# EAGLE design 100kw-DC-Motor-ESC  (EAGLE 7.4.0)
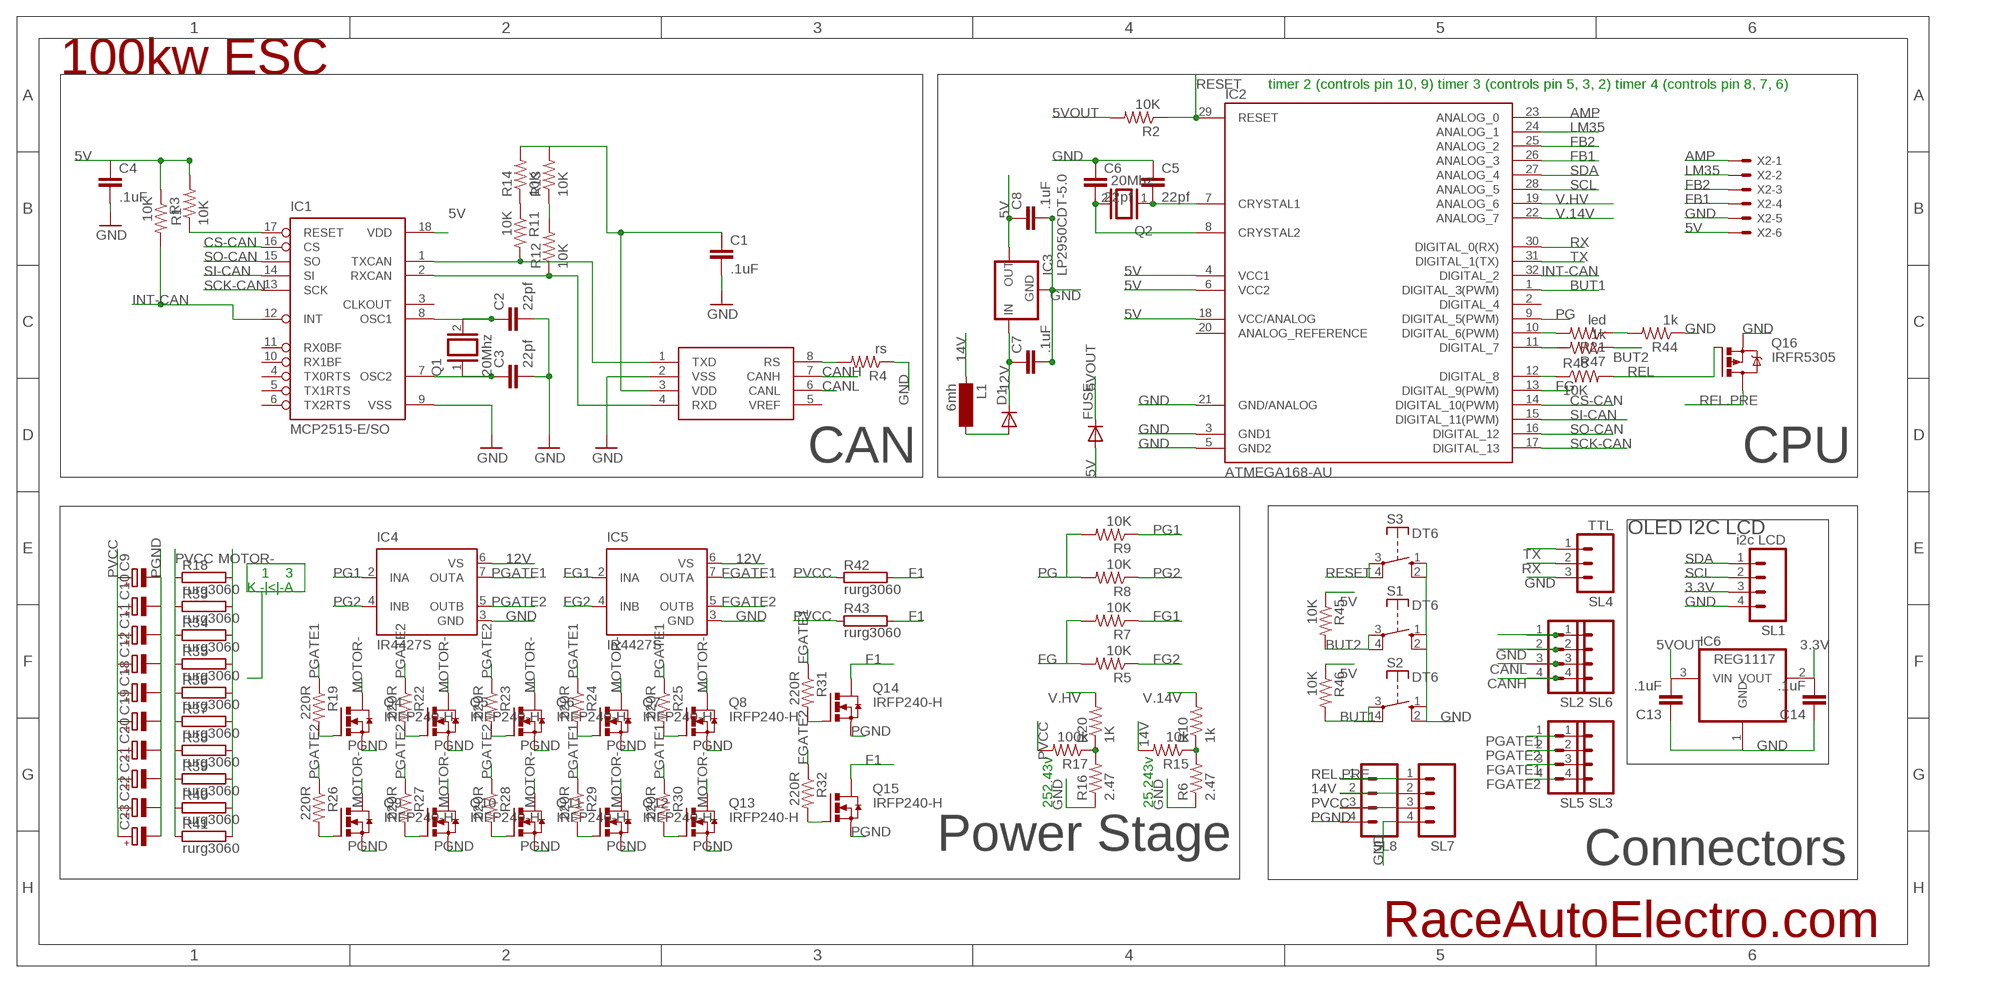
[diagram p0: schematic, sheet 1]

## Parts
C1  .1uF  CAP0805  [0805]
C2  22pf  CAP0805  [0805]
C3  22pf  CAP0805  [0805]
C4  .1uF  CAP1210  [1210]
C5  22pf  CAP0805  [0805]
C6  22pf  CAP0805  [0805]
C7  .1uF  CAP1210  [1210]
C8  .1uF  CAP1210  [1210]
C9  CPOL-EUE10-35  [EB35D]
C10  CPOL-EUE10-35  [EB35D]
C11  CPOL-EUE10-35  [EB35D]
C12  CPOL-EUE10-35  [EB35D]
C13  .1uF  CAP1210  [1210]
C14  .1uF  CAP1210  [1210]
C18  CPOL-EUE10-35  [EB35D]
C19  CPOL-EUE10-35  [EB35D]
C20  CPOL-EUE10-35  [EB35D]
C21  CPOL-EUE10-35  [EB35D]
C22  CPOL-EUE10-35  [EB35D]
C23  CPOL-EUE10-35  [EB35D]
D1  DIODE-DO-214AC  [DO-214AC]
FUSE  DIODE-DO-214AC  [DO-214AC]
IC1  MCP2515-E/SO  [SO18L]
IC2  ATMEGA168-AU  [TQFP32-08]
IC3  LP2950CDT-5.0  [DPACK]
IC4  IR4427S  [SO08]
IC5  IR4427S  [SO08]
IC6  REG1117  [SOT223]
L1  6mh  MS85  [MS85]
Q1  20Mhz  XTAL/S  [QS]
Q2  20Mhz  XTAL/S  [QS]
Q4  IRFP240-H  [TO247BH]
Q5  IRFP240-H  [TO247BH]
Q6  IRFP240-H  [TO247BH]
Q7  IRFP240-H  [TO247BH]
Q8  IRFP240-H  [TO247BH]
Q9  IRFP240-H  [TO247BH]
Q10  IRFP240-H  [TO247BH]
Q11  IRFP240-H  [TO247BH]
Q12  IRFP240-H  [TO247BH]
Q13  IRFP240-H  [TO247BH]
Q14  IRFP240-H  [TO247BH]
Q15  IRFP240-H  [TO247BH]
Q16  IRFR5305  [D-PAK_TO252AA]
R1  10K  RESISTOR0805-RES  [0805]
R2  10K  RESISTOR1206  [1206]
R3  10K  RESISTOR0805-RES  [0805]
R4  rs  RESISTOR0805-RES  [0805]
R5  10K  RESISTOR0805-RES  [0805]
R6  2.47  RESISTOR0805-RES  [0805]
R7  10K  RESISTOR0805-RES  [0805]
R8  10K  RESISTOR0805-RES  [0805]
R9  10K  RESISTOR0805-RES  [0805]
R10  1k  RESISTOR0805-RES  [0805]
R11  10K  RESISTOR0805-RES  [0805]
R12  10K  RESISTOR0805-RES  [0805]
R13  10K  RESISTOR0805-RES  [0805]
R14  10K  RESISTOR0805-RES  [0805]
R15  10k  RESISTOR0805-RES  [0805]
R16  2.47  RESISTOR0805-RES  [0805]
R17  100k  RESISTOR0805-RES  [0805]
R18  rurg3060  RMG100-H  [TO-247-2H]
R19  220R  RESISTOR0805-RES  [0805]
R20  1K  RESISTOR0805-RES  [0805]
R21  led  RESISTOR1206  [1206]
R22  220R  RESISTOR0805-RES  [0805]
R23  220R  RESISTOR0805-RES  [0805]
R24  220R  RESISTOR0805-RES  [0805]
R25  220R  RESISTOR0805-RES  [0805]
R26  220R  RESISTOR0805-RES  [0805]
R27  220R  RESISTOR0805-RES  [0805]
R28  220R  RESISTOR0805-RES  [0805]
R29  220R  RESISTOR0805-RES  [0805]
R30  220R  RESISTOR0805-RES  [0805]
R31  220R  RESISTOR0805-RES  [0805]
R32  220R  RESISTOR0805-RES  [0805]
R33  rurg3060  RMG100-H  [TO-247-2H]
R34  rurg3060  RMG100-H  [TO-247-2H]
R35  rurg3060  RMG100-H  [TO-247-2H]
R36  rurg3060  RMG100-H  [TO-247-2H]
R37  rurg3060  RMG100-H  [TO-247-2H]
R38  rurg3060  RMG100-H  [TO-247-2H]
R39  rurg3060  RMG100-H  [TO-247-2H]
R40  rurg3060  RMG100-H  [TO-247-2H]
R41  rurg3060  RMG100-H  [TO-247-2H]
R42  rurg3060  RMG100-H  [TO-247-2H]
R43  rurg3060  RMG100-H  [TO-247-2H]
R44  1k  RESISTOR0805-RES  [0805]
R45  10K  RESISTOR0805-RES  [0805]
R46  10K  RESISTOR0805-RES  [0805]
R47  1k  RESISTOR0805-RES  [0805]
R48  10K  RESISTOR0805-RES  [0805]
S1  DT6  [DT6]
S2  DT6  [DT6]
S3  DT6  [DT6]
SL1  i2c LCD  M04  [04P]
SL2  M04  [04P]
SL3  M04  [04P]
SL4  TTL  M03  [03P]
SL5  M04  [04P]
SL6  M04  [04P]
SL7  M04  [04P]
SL8  M04  [04P]
U1  MCP2551  [SO08]
X2  22-23-2061  [22-23-2061]

## Nets
3.3V: C14.2 IC6.2(VOUT) SL1.3
5V: C1.1 C4.1 C8.1 FUSE.A IC1.18(VDD) IC2.4(VCC1) IC2.6(VCC2) IC2.18(VCC/ANALOG) IC3.3(OUT) R1.2 R3.1 R13.2 R14.2 R45.1 R46.1 U1.3(VDD) X2.6
5VOUT: C13.2 FUSE.C IC6.3(VIN) R2.2
12V: C7.1 D1.C IC3.1(IN) IC4.6(VS) IC5.6(VS)
14V: L1.1 R15.2 SL7.2 SL8.2
AMP: IC2.23(ANALOG_0) X2.1
BUT1: IC2.1(DIGITAL_3(PWM)) R46.2 S2.3(P) S2.4(P)
BUT2: R45.2 R47.1 S1.3(P) S1.4(P)
BUT2R: IC2.11(DIGITAL_7) R47.2
CANH: SL2.4 SL6.4 U1.7(CANH)
CANL: SL2.3 SL6.3 U1.6(CANL)
CS-CAN: IC1.16(CS) IC2.14(DIGITAL_10(PWM))
F1: Q14.D Q15.D R42.2 R43.2
FB1: IC2.26(ANALOG_3) X2.4
FB2: IC2.25(ANALOG_2) X2.3
FG: IC2.13(DIGITAL_9(PWM)) R5.2 R7.2
FG1: IC5.2(INA) R7.1
FG2: IC5.4(INB) R5.1
FGATE1: IC5.7(OUTA) R31.1 SL3.3 SL5.3
FGATE2: IC5.5(OUTB) R32.1 SL3.4 SL5.4
GND: C1.2 C2.2 C3.2 C4.2 C5.1 C6.1 C7.2 C8.2 C13.1 C14.1 IC1.9(VSS) IC2.3(GND1) IC2.5(GND2) IC2.21(GND/ANALOG) IC3.4(GND) IC4.3(GND) IC5.3(GND) IC6.1(GND) Q16.3(S) R4.1 R6.1 R16.1 R44.1 S1.1(S) S1.2(S) S2.1(S) S2.2(S) S3.1(S) S3.2(S) SL1.4 SL2.2 SL4.3 SL6.2 SL7.4 U1.2(VSS) X2.5
INT-CAN: IC1.12(INT) IC2.32(DIGITAL_2) R3.2
LM35: IC2.24(ANALOG_1) X2.2
MOTOR-: Q4.D Q5.D Q6.D Q7.D Q8.D Q9.D Q10.D Q11.D Q12.D Q13.D R18.2 R33.2 R34.2 R35.2 R36.2 R37.2 R38.2 R39.2 R40.2 R41.2
N$1: R4.2 U1.8(RS)
N$2: IC1.1(TXCAN) R11.2 U1.1(TXD)
N$3: IC1.2(RXCAN) R12.1 U1.4(RXD)
N$4: C2.1 IC1.8(OSC1) Q1.2
N$5: C3.1 IC1.7(OSC2) Q1.1
N$6: C5.2 IC2.7(CRYSTAL1) Q2.1
N$7: Q4.G R19.2
N$8: IC1.17(RESET) R1.1
N$9: C6.2 IC2.8(CRYSTAL2) Q2.2
N$11: IC2.12(DIGITAL_8) R48.1
N$13: D1.A L1.2
N$15: R12.2 R13.1
N$16: Q5.G R22.2
N$17: R11.1 R14.1
N$18: Q6.G R23.2
N$19: Q7.G R24.2
N$20: Q8.G R25.2
N$21: Q9.G R26.2
N$22: Q10.G R27.2
N$23: Q11.G R28.2
N$24: Q12.G R29.2
N$25: Q13.G R30.2
N$26: Q14.G R31.2
N$27: Q15.G R32.2
N$39: SL2.1 SL6.1
N$55: R6.2 R10.1 R15.1
N$57: IC2.10(DIGITAL_6(PWM)) R21.2
N$58: R21.1 R44.2
N$59: R16.2 R17.1 R20.1
PG: IC2.9(DIGITAL_5(PWM)) R8.2 R9.2
PG1: IC4.2(INA) R9.1
PG2: IC4.4(INB) R8.1
PGATE1: IC4.7(OUTA) R19.1 R24.1 R25.1 R29.1 R30.1 SL3.1 SL5.1
PGATE2: IC4.5(OUTB) R22.1 R23.1 R26.1 R27.1 R28.1 SL3.2 SL5.2
PGND: C9.- C10.- C11.- C12.- C18.- C19.- C20.- C21.- C22.- C23.- Q4.S Q5.S Q6.S Q7.S Q8.S Q9.S Q10.S Q11.S Q12.S Q13.S Q14.S Q15.S SL8.4
PVCC: C9.+ C10.+ C11.+ C12.+ C18.+ C19.+ C20.+ C21.+ C22.+ C23.+ R17.2 R18.1 R33.1 R34.1 R35.1 R36.1 R37.1 R38.1 R39.1 R40.1 R41.1 R42.1 R43.1 SL7.3 SL8.3
REL: Q16.1(G) R48.2
REL.PRE: Q16.4(D) SL7.1 SL8.1
RESET: IC2.29(RESET) R2.1 S3.3(P) S3.4(P)
RX: IC2.30(DIGITAL_0(RX)) SL4.2
SCK-CAN: IC1.13(SCK) IC2.17(DIGITAL_13)
SCL: IC2.28(ANALOG_5) SL1.2
SDA: IC2.27(ANALOG_4) SL1.1
SI-CAN: IC1.14(SI) IC2.15(DIGITAL_11(PWM))
SO-CAN: IC1.15(SO) IC2.16(DIGITAL_12)
TX: IC2.31(DIGITAL_1(TX)) SL4.1
V.14V: IC2.22(ANALOG_7) R10.2
V.HV: IC2.19(ANALOG_6) R20.2
Unconnected: IC1.3(CLKOUT) IC1.4(TX0RTS) IC1.5(TX1RTS) IC1.6(TX2RTS) IC1.10(RX1BF) IC1.11(RX0BF) IC2.2(DIGITAL_4) IC2.20(ANALOG_REFERENCE) U1.5(VREF)

## Notes on the sheet
- 100kw ESC
- timer 2 (controls pin 10, 9) timer 3 (controls pin 5, 3, 2) timer 4 (controls pin 8, 7, 6)
- CAN | CPU
- OLED I2C LCD
- 1    3
- K -|<|-A
- 252.43v | 25.243v
- Power Stage | Connectors
- RaceAutoElectro.com

## Library data of the parts
C1-C8 C13 C14 = SparkFun:CAP: Capacitor Standard 0603 ceramic capacitor, and 0.1" leaded capacitor.
C9-C12 C18-C23 = rcl:CPOL-EU: POLARIZED CAPACITOR, European symbol
D1 FUSE = diode:DIODE-: DIODE
IC1 = mcp2515:MCP2515
IC2 = Arduino-AVR:ATMEGA168
IC3 = v-reg:LP2950?*: Source: http://cache.national.com/ds/LP/LP2950.pdf
IC4 IC5 = ir:IR4427: DUAL LOW SIDE DRIVER Source: ID4426.pdf; MF: INTERNATIONAL RECTIFIER(IR); MPN: IR4427STRPBF; OC_FARNELL: 8639094; OC_NEWARK: 63J7933
IC6 = burr-brown:REG1117: 800mA and 1A Low Dropout (LDO) Positive Regulator 1.8V, 2.5V, 2.85V, 3.3V, 5V, and Adj; MPN: REG1117; OC_FARNELL: 1097566; OC_NEWARK: 14P6981
L1 = inductor-neosid:MS85: INDUCTOR SMD power inductor
Q1 Q2 = special:XTAL/S: CRYSTAL
Q4-Q15 = transistor-power:IRFP240: HEXFET Power MosFet Source: http://www.irf.com/
Q16 = transistor-power:IRF?5305: HEXFET Power MOSFET Source: http://www.irf.com/product-info/datasheets/data/irfr5305pbf.pdf
R1-R17 R19-R32 R44-R48 = SparkFun:RESISTOR: Resistor Basic schematic elements and footprints for 0603, 1206, and PTH resistors.
R18 R33-R43 = resistor-power:RMG100: TO-247 Power Resistor - RMG 100 Series Source: www.token.com.tw .. power-resistor-rmg100pdf; OC_FARNELL: unknown; OC_NEWARK: unknown
S1-S3 = switch-misc:DT: ITT SWITCH
SL1-SL3 SL5-SL8 = con-amp-quick:M04: AMP QUICK CONNECTOR; OC_FARNELL: unknown; OC_NEWARK: unknown
SL4 = con-amp-quick:M03: AMP QUICK CONNECTOR; OC_FARNELL: unknown; OC_NEWARK: unknown
U1 = SparkFun:MCP2551
X2 = con-molex:22-23-2061: .100" (2.54mm) Center Header - 6 Pin; MF: MOLEX; MPN: 22-23-2061; OC_FARNELL: 1462922; OC_NEWARK: 27C1933

## Board
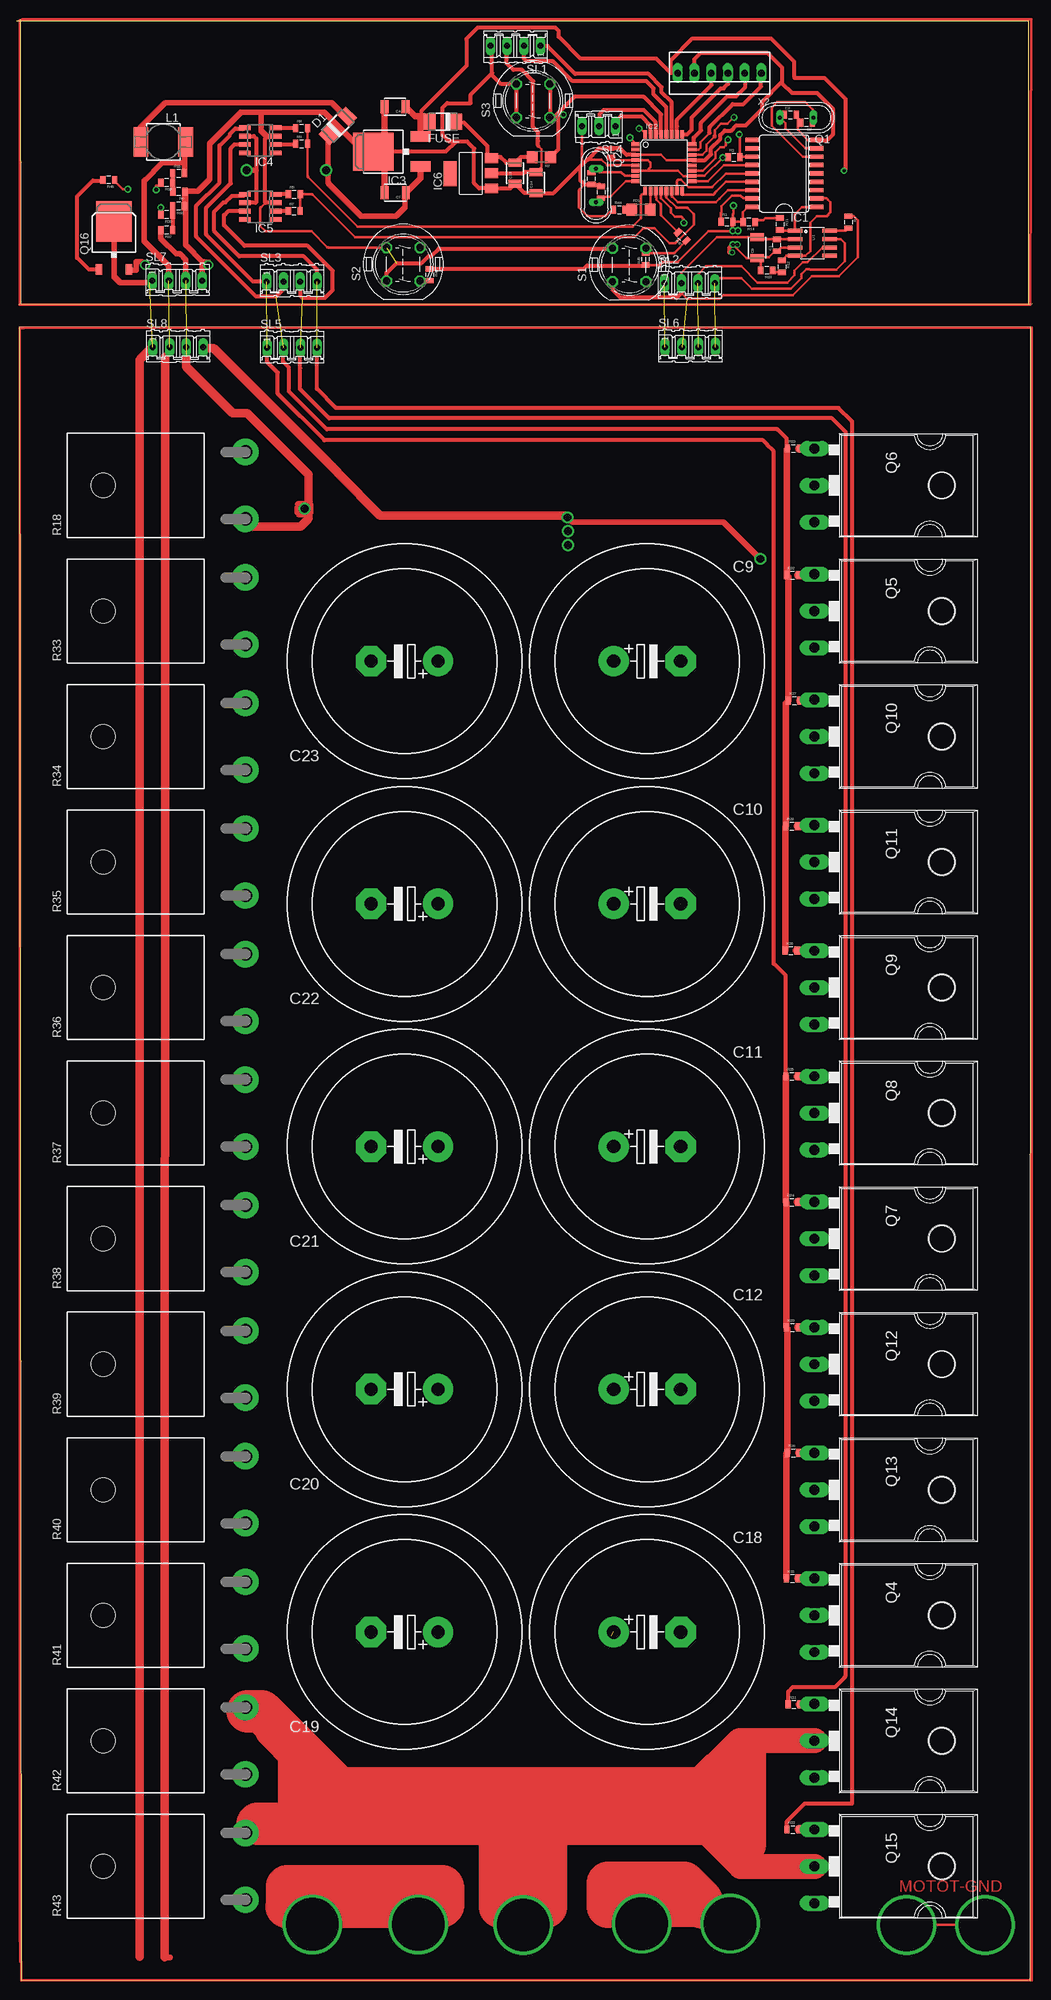
[diagram p1: board, top side]
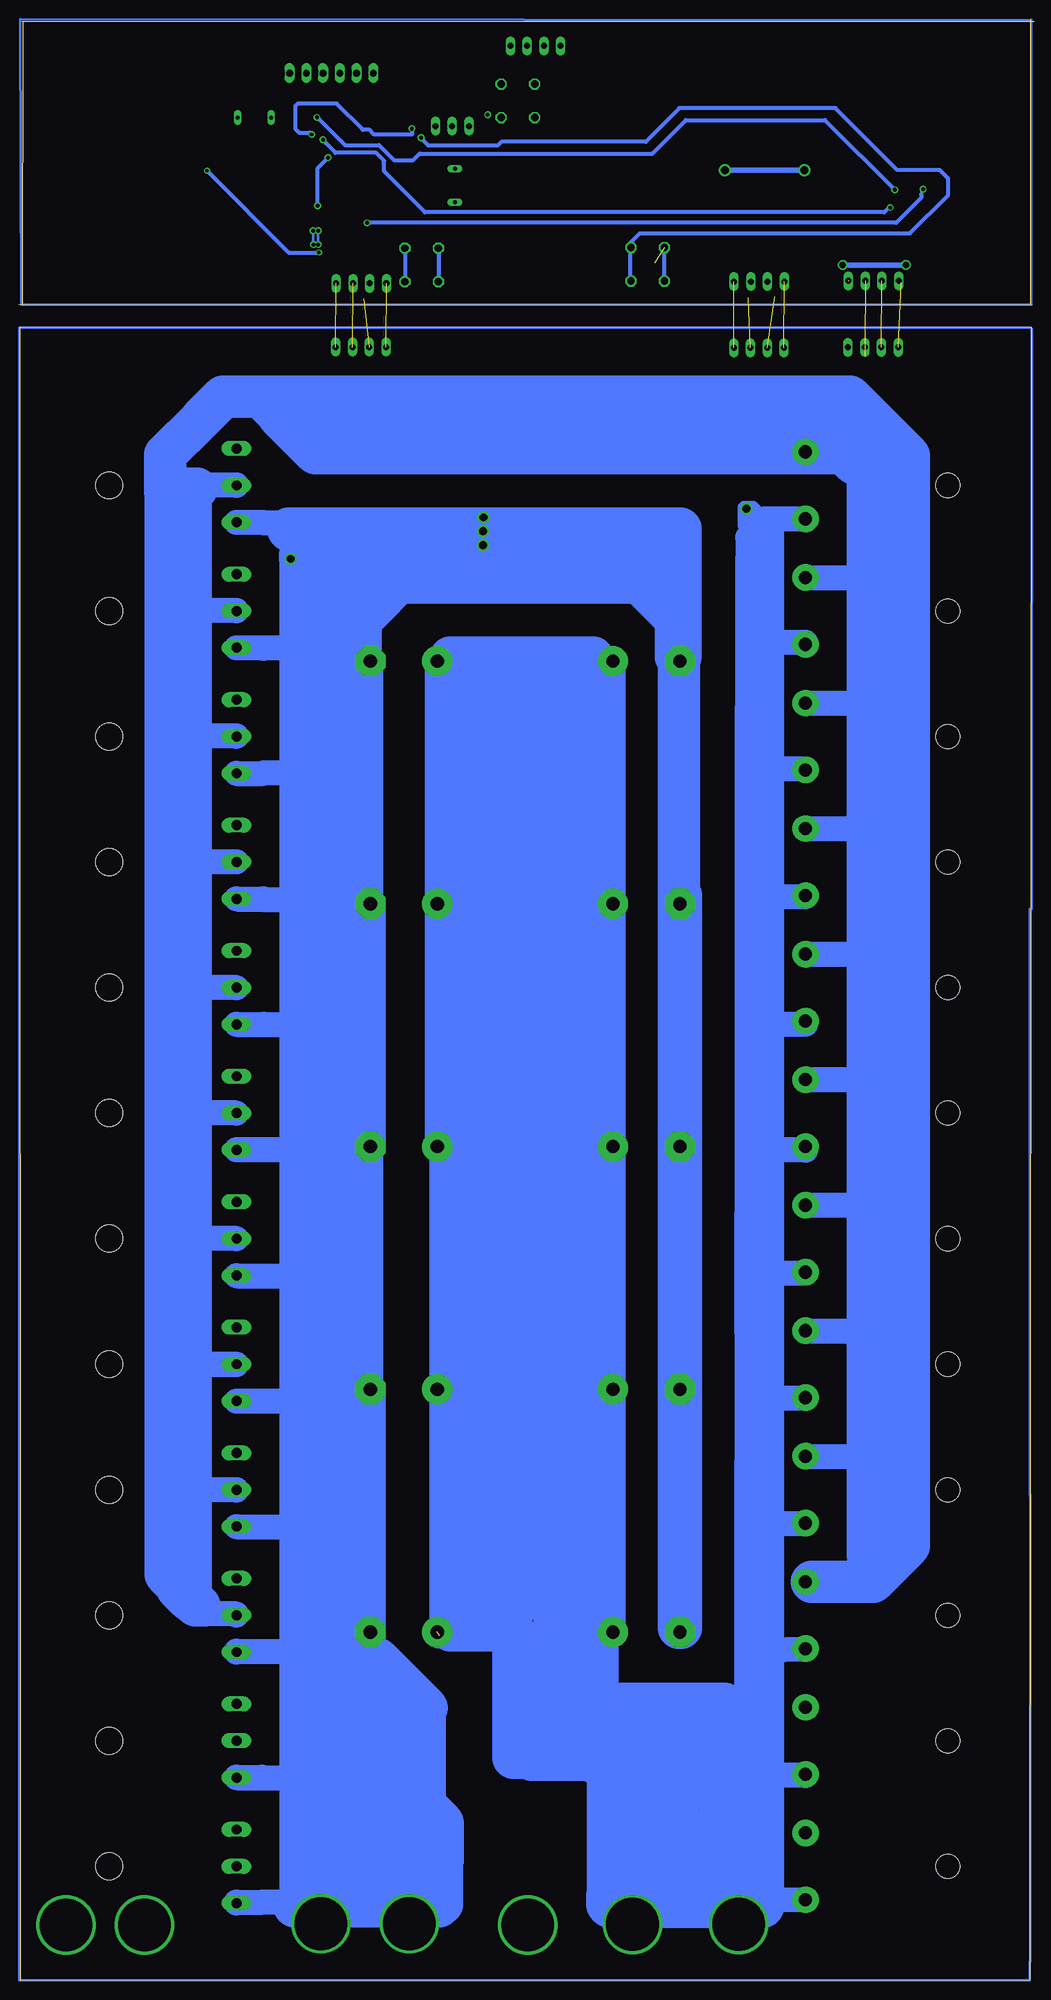
[diagram p2: board, bottom side, seen from below]

Size 154.1 x 297.62 mm. Coordinates in mm from the lower left corner, seen from the top.
Outline: 154.1,254.41 0.3,254.34
Outline: 153.53,297.38 153.56,254.34
Outline: 0.56,297.62 0.57,254.5
Outline: 153.6,297.31 0,297.34
Outline: 0.66,0.06 153.83,0 153.89,251.01 0.41,250.96 0.66,0.06
Copper layers (1*16): Top 0.035mm / dielectric 1.5mm / Bottom 0.035mm
Design rules "default": minimum track width 10mil, minimum drill 24mil, track to track 8mil, track to pad 8mil, pad to pad 8mil, via to via 8mil, smd to smd 8mil, copper to edge 40mil, drill to drill 8mil, minimum pad ring 10mil, minimum via ring 8mil, stop-mask expansion 4mil, vias tented up to drill 0mil, thermal gap 10mil

### Footprints (pad centres in the part's own frame; a part is rotated, then mirrored left to right if it is on the bottom)
0805 = smd 0.8 x 1.2: 1 -0.9,0; 2 0.9,0
1210 = smd 1.2 x 2: 1 -1.6,0; 2 1.6,0
EB35D = drill 2.007 pad 4.597: + -5.08,0 | drill 2.007 pad 4.597 octagon: - 5.08,0
DO-214AC = smd 1.8 x 2.4: A 2.025,0; C -2.025,0
SO18L = smd 0.66 x 2.032: 1 -5.08,-4.902; 2 -3.81,-4.902; 3 -2.54,-4.902; 4 -1.27,-4.902; 5 0,-4.902; 6 1.27,-4.902; 7 2.54,-4.902; 8 3.81,-4.902; 9 5.08,-4.902; 10 5.08,4.902; 11 3.81,4.902; 12 2.54,4.902; 13 1.27,4.902; 14 0,4.902; 15 -1.27,4.902; 16 -2.54,4.902; 17 -3.81,4.902; 18 -5.08,4.902
TQFP32-08 = smd 1.27 x 0.559: 1 -4.293,2.8; 2 -4.293,2; 3 -4.293,1.2; 4 -4.293,0.4; 5 -4.293,-0.4; 6 -4.293,-1.2; 7 -4.293,-2; 8 -4.293,-2.8; 17 4.293,-2.8; 18 4.293,-2; 19 4.293,-1.2; 20 4.293,-0.4; 21 4.293,0.4; 22 4.293,1.2; 23 4.293,2; 24 4.293,2.8 | smd 0.559 x 1.27: 9 -2.8,-4.293; 10 -2,-4.293; 11 -1.2,-4.293; 12 -0.4,-4.293; 13 0.4,-4.293; 14 1.2,-4.293; 15 2,-4.293; 16 2.8,-4.293; 25 2.8,4.293; 26 2,4.293; 27 1.2,4.293; 28 0.4,4.293; 29 -0.4,4.293; 30 -1.2,4.293; 31 -2,4.293; 32 -2.8,4.293
DPACK = smd 1.6 x 3: 1 -2.28,-4.8; 3 2.28,-4.8 | smd 5.8 x 6.2: 4 0,2.38
SO08 = smd 0.72 x 1.78: 1 -1.905,-2.35; 2 -0.635,-2.35; 3 0.635,-2.35; 4 1.905,-2.35; 5 1.905,2.35; 6 0.635,2.35; 7 -0.635,2.35; 8 -1.905,2.35
SOT223 = smd 1.499 x 2.007: 1 -2.261,-3.15; 2 0.025,-3.15; 3 2.311,-3.15 | smd 3.81 x 2.007: 4 0,3.15
MS85 = smd 4.5 x 2.25: 1 0,-3.383; 2 0,3.383
QS = drill 0.61 long: 1 -2.54,0; 2 2.54,0
TO247BH = drill 1.499 long: D 0,-10.16; G -5.588,-10.16; S 5.588,-10.16 | hole 4.115: 0,9.144
D-PAK_TO252AA = smd 1 x 1.6: 1 -2.28,-4.8; 3 2.28,-4.8 | smd 5.4 x 6.2: 4 0,2.5
1206 = smd 1.6 x 1.8: 1 -1.4,0; 2 1.4,0
TO-247-2H = drill 2 pad 4: 1 -5.08,-21.59; 2 5.08,-21.59 | hole 3.7: 0,0
DT6 = drill 1.118 octagon: 1 -2.54,2.54; 2 2.54,2.54; 3 2.54,-2.54; 4 -2.54,-2.54
04P = drill 0.914 long: 1 -3.81,0; 2 -1.27,0; 3 1.27,0; 4 3.81,0
03P = drill 0.914 long: 1 -2.54,0; 2 0,0; 3 2.54,0
SO08' = smd 0.61 x 2.21: 1 -1.905,-2.616; 2 -0.635,-2.616; 3 0.635,-2.616; 4 1.905,-2.616; 5 1.905,2.616; 6 0.635,2.616; 7 -0.635,2.616; 8 -1.905,2.616
22-23-2061 = drill 1 long: 1 -6.35,0; 2 -3.81,0; 3 -1.27,0; 4 1.27,0; 5 3.81,0; 6 6.35,0

### Placement (x,y rotation side)
C1  115.39,263.34 90 top
C2  117.42,283.13 0 top
C3  119.86,281.95 180 top
C4  57.41,284.37 180 top
C5  87.24,273.47 90 top
C6  88.68,271.38 270 top
C7  57.45,271.32 180 top
C8  112.37,262.96 90 top
C9  95.68,200.24 0 top
C10  95.68,163.41 0 top
C11  95.68,126.58 0 top
C12  95.68,89.75 0 top
C13  75.62,274.27 90 top
C14  78.8,272.86 90 top
C18  95.68,52.92 0 top
C19  58.85,52.92 180 top
C20  58.85,89.75 180 top
C21  58.85,126.58 180 top
C22  58.85,163.41 180 top
C23  58.85,200.24 180 top
D1  48.72,281.45 45 top
FUSE  64.69,282.07 180 top
IC1  116.48,274.24 90 top
IC2  98.2,275.87 0 top
IC3  56.49,277.56 90 top
IC4  36.97,279.26 90 top
IC5  36.96,269.17 90 top
IC6  68.91,274.23 90 top
L1  22.23,279.02 90 top
Q1  118.38,282.72 180 top
Q2  87.93,272.41 270 top
Q4  131.24,55.46 270 top
Q5  131.24,207.86 270 top
Q6  131.24,226.91 270 top
Q7  131.24,112.61 270 top
Q8  131.24,131.66 270 top
Q9  131.24,150.71 270 top
Q10  131.24,188.81 270 top
Q11  131.24,169.76 270 top
Q12  131.24,93.56 270 top
Q13  131.24,74.51 270 top
Q14  131.24,36.41 270 top
Q15  131.24,17.36 270 top
Q16  14.76,264.46 0 top
R1  107.8,266.95 0 top
R2  79.61,276.73 180 top
R3  108.86,276.71 0 top
R4  126.24,266.85 270 top
R5  42.12,271.11 0 top
R6  24.6,271.45 180 top
R7  42.11,268.56 0 top
R8  43.23,281.12 0 top
R9  43.23,278.76 0 top
R10  22.76,272.86 180 top
R11  115.85,266.58 270 top
R12  116.11,260.13 270 top
R13  113.82,259.53 180 top
R14  111.15,266.83 180 top
R15  24.56,274.26 0 top
R16  24.56,269.26 180 top
R17  22.76,265.66 180 top
R18  13.13,226.91 90 top
R19  117.7,61.04 0 top
R20  22.76,267.96 180 top
R21  94.76,268.76 0 top
R22  117.75,213.29 0 top
R23  117.88,232.53 0 top
R24  117.64,118.14 0 top
R25  117.63,137.25 0 top
R26  117.53,156.34 0 top
R27  118.01,194.28 0 top
R28  117.63,175.24 0 top
R29  117.72,99.12 0 top
R30  117.85,80.13 0 top
R31  117.98,41.91 0 top
R32  117.79,22.95 0 top
R33  13.13,207.86 90 top
R34  13.13,188.81 90 top
R35  13.13,169.76 90 top
R36  13.13,150.71 90 top
R37  13.13,131.66 90 top
R38  13.13,112.61 90 top
R39  13.13,93.56 90 top
R40  13.13,74.51 90 top
R41  13.13,55.46 90 top
R42  13.13,36.41 90 top
R43  13.13,17.36 90 top
R44  91.46,268.76 0 top
R45  95.46,261.26 90 top
R46  62.66,258.86 270 top
R47  101,264.67 135 top
R48  13.96,273.26 180 top
S1  92.96,260.36 90 top
S2  58.66,260.46 90 top
S3  78.36,285.26 90 top
SL1  75.71,293.61 180 top
SL2  102.14,257.56 0 top
SL3  41.74,257.85 0 top
SL4  88.35,281.44 180 top
SL5  41.78,247.78 0 top
SL6  102.2,247.92 0 top
SL7  24.36,257.96 0 top
SL8  24.46,247.86 0 top
U1  MCP2551  [SO08']  120.74,263.64 270 top
X2  106.66,289.46 180 top

### Tracks (layer width: path | path; a pad name or v marks a point on that pad's centre or on a via)
3.3V
  Top 0.406: 79.13,278.45 79.64,277.94 79.64,275.3 C14.2
  Top 0.6: 79.13,278.45 79.13,279.16 | 74.36,291.56 74.36,292.06 74.36,293.53 SL1.3
  Top 0.61: C14.2 77.06,274.46 76.84,274.24 72.07,274.24 IC6.2 | 79.13,279.16 79.13,280.49 78.36,281.26 78.36,288.26 76.66,289.96 75.36,289.96 74.36,290.96 74.36,292.06
5V  (via drill 0.5, 0.6)
  Top 0.406: U1.3 115.96,263.01 C1.1 115.04,262.44 114.13,261.54 112.55,261.54 C8.1 | R13.2 112.92,260.81 C8.1 | R1.2 110.13,266.95 R14.2 110.2,266.88 110.2,268.38 110.98,269.16 IC1.18 | 108.66,266.26 108.56,266.26 | 108.66,266.26 v108.66,265.56 v108.65,265.55 arc-45 108.43,265.46 104.96,265.46 100.35,260.85 arc-45 100.13,260.76 98.09,260.76 arc45 97.87,260.67 97.56,260.36 R45.1 | 112.56,261.66 C8.1 | 108.66,266.26 108.66,266.76 R1.2 | v108.66,263.46 110.76,261.36 112.16,261.36 C8.1 | v108.76,269.36 108.76,268.16 108.66,268.06 108.66,267.16 R1.2 | 89.86,276.56 89.76,276.56 89.95,276.37 arc45 90.18,276.27 IC2.4 95.78,276.27 96.09,275.97 96.11,275.97 96.17,275.9 96.17,275.16 95.69,274.67 IC2.6 100.35,274.67 101.16,273.86 102.49,273.86 IC2.18 104.37,273.87 v107.16,276.66 107.91,276.66 R3.1 | 89.86,276.56 90.66,276.56 90.66,276.96 89.76,276.96 89.76,276.79 arc45 89.85,276.57 89.86,276.56 | 64.29,286.46 arc45 64.07,286.37 61.36,283.66 61.36,282.62 arc-45 61.29,282.46
  Top 0.6: X2.6 99.26,289.46 | 99.26,289.46 97.06,291.66 85.56,291.66 82.26,294.96 82.26,295.86 81.76,296.36 69.96,296.36 68.26,294.66 68.26,290.56 61.36,283.66 | 99.26,289.46 99.26,291.46 102.56,294.76 114.46,294.76 117.96,291.26 117.96,288.86 118.06,288.76 122.56,288.76 125.76,285.56 125.76,274.86 v125.56,274.66 | v108.56,262.26 108.16,262.26 108.16,262.96 v108.66,263.46
  Top 0.61: R46.1 86.06,259.76 86.56,260.26 95.36,260.26 R45.1
  Top 1.016: C4.1 60.44,282.95 61.46,282.95 | 61.46,282.95 61.79,282.95 FUSE.A | IC3.3 61.29,282.46 61.29,282.78 61.46,282.95
  Bottom 0.406: v108.66,263.46 v108.66,265.56
  Bottom 0.6: v108.76,269.36 108.76,275.06 v107.16,276.66 | v108.56,262.26 113.16,262.26 v125.56,274.66
5VOUT
  Top 0.61: FUSE.C 67.88,281.98 71.4,278.45 71.4,277.2 IC6.3 72.23,276.72 73.45,276.72 74.3,275.87 C13.2 76.48,276.73 R2.2
12V  (via drill 1.2)
  Top 0.61: IC4.6 35.96,279.9 36.2,279.66 36.22,279.66 36.35,279.53 36.35,274.76 36.35,269.89 36.24,269.79 34.63,269.79 IC5.6
  Top 0.813: D1.C 47.29,274.76 | 47.29,274.76 47.29,272.86 arc45 47.38,272.64 52.26,267.76 57.43,267.76 arc45 57.65,267.85 58.96,269.16 58.96,271.1 arc-45 C7.1 | v46.96,274.76 47.29,274.76 | v34.86,274.76 36.35,274.76
  Top 1.016: IC3.1 61.29,273.56 C7.1
  Bottom 0.813: v46.96,274.76 v34.86,274.76
14V  (1 unrouted)
  Top 0.813: R15.2 25.46,275.66 | 25.46,275.66 25.46,278.74 arc-45 25.55,278.96 L1.1 | SL7.2 23.09,260.1 arc45 23,260.32 19.36,263.96 19.36,273.03 arc-45 19.45,273.25 22.06,275.86 25.13,275.86 arc-45 25.35,275.77 25.46,275.66 | SL8.2 arc-45 22.58,246.37 22.56,246.36
AMP
  Top 0.406: 105.16,280.36 103.76,278.96 103.76,278.16 103.47,277.87 IC2.23
  Top 0.6: X2.1 112.96,287.41 110.31,284.76 108.66,284.76 105.16,281.26 105.16,280.36
BUT1  (via drill 0.6)
  Top 0.406: R46.2 v61.3,257.96 arc45 S2.4 | v93.06,279.66 93.96,278.76 IC2.1
  Bottom 0.406: 61.3,262.8 arc45 61.22,262.98 S2.3
  Bottom 0.6: v61.3,257.96 61.3,262.9 | 61.3,262.9 S2.3 | 61.3,262.9 61.3,263.72 59.86,265.16 18.86,265.16 13.06,270.96 13.06,273.46 14.36,274.76 20.76,274.76 30.16,284.16 53.86,284.16 58.96,279.06 80.86,279.06 81.46,278.46 91.96,278.46 93.06,279.56 v93.06,279.66
BUT2
  Top 0.406: 99.86,262.26 R47.1 99.83,262.23 arc-45 99.66,262.16 R45.2 arc45 95.5,262.26 S1.3
  Bottom 0.6: S1.3 S1.4
BUT2R
  Top 0.406: IC2.11 97,270.75 arc-45 97.06,270.61 97.06,270.26 97.69,269.63 arc-45 97.76,269.45 97.76,268.04 arc45 97.85,267.82 R47.2
CANH  (1 unrouted)
  Top 0.406: U1.7 125.09,264.28 125.68,263.69 125.68,260.92 124.41,259.65 120.42,259.65 120.33,259.74 119.88,259.74 119.06,258.93 119.06,258.38 117.48,256.8 111.54,256.8 110,258.34 106.73,258.34 SL2.4
CANL  (1 unrouted)
  Top 0.406: U1.6 122.24,263.01 120.02,260.79 119.29,260.79 118.02,259.52 118.02,258.79 116.93,257.7 112.45,257.7 110,260.15 104.61,260.15 103.43,258.97 103.43,257.58 SL2.3
CS-CAN
  Top 0.406: IC1.16 107.94,271.7 106.63,270.39 | 106.63,270.39 | 106.63,270.39 106.11,269.88 100.32,269.88 99.48,270.71 arc-45 99.41,270.89 IC2.14
F1
  Top 3.81: Q14.D 109.68,36.41 106.18,32.91 106.05,32.91 103.61,30.47 | 103.61,30.47 49.44,30.47 38.74,41.17 35.03,41.17 R42.2 | R43.2 34.97,22.69 35.38,22.69 36.54,23.85 103.3,23.85 104.33,22.82 104.42,22.82 109.88,17.36 Q15.D | 103.61,30.47 103.61,26.52 103.58,26.48 102.45,26.48 101.04,27.89
  Top 6.452: 101.04,27.89 101.04,26.48 102.26,25.26 52.15,25.26 49.03,28.38 49.03,28.53 43.25,34.32 | 43.25,34.32 39.28,38.29 39.28,38.78 37.16,40.89 35.05,40.89 | 36.54,23.85 107.39,23.85 110.5,20.74 110.5,34.55 110.34,34.71 110.34,31.47 106.92,28.05 44.13,28.05 42.84,26.77 42.84,33.91 43.25,34.32
FB1
  Top 0.6: IC2.26 100.2,281.4 | 101.06,283.26 105.46,287.66 105.46,289.39 X2.4
  Top 0.61: 100.2,281.4 100.2,282.4 101.06,283.26
FB2
  Top 0.6: IC2.25 101.77,280.17 102.46,280.86 102.46,282.76 106.86,287.16 107.26,287.16 107.96,287.86 107.96,289.43 X2.3
FG
  Top 0.406: R7.2 43.02,268.58 R5.2 44.68,271.11 arc-45 44.9,271.02 51.36,264.56 93.73,264.56 95.04,265.87 arc-45 95.26,265.96 96.63,265.96 arc-45 96.85,265.87 99.06,263.66 99.83,263.66 arc45 100.05,263.75 102.76,266.46 102.76,267.93 arc45 102.67,268.15 101.85,268.97 arc45 101.63,269.06 100.27,269.06 arc-45 100.09,269.13 98.63,270.59 arc-45 98.56,270.76 98.56,271.48 arc-45 IC2.13
FG1
  Top 0.406: 41.18,268.53 R7.1
  Top 0.61: 41.18,268.53 IC5.2
FG2
  Top 0.406: 41.19,271.07 R5.1
  Top 0.61: 41.19,271.07 IC5.4
FGATE1  (1 unrouted)
  Top 0.61: R31.1 117.08,43.86 117.79,44.57 arc45 117.82,44.56 124.16,44.56 125.67,46.07 arc45 125.76,46.29 125.76,235.06 123.76,237.06 arc-45 123.74,237.1 47.42,237.1 42.97,241.55 42.97,244.6 42.97,244.8 42.97,244.84 42.98,244.85 42.98,247.71 SL5.3 | SL3.3 43.01,255.71 43.36,255.36 46.76,255.36 47.96,256.56 47.96,259.46 44.16,263.26 34.56,263.26 31.46,266.36 31.46,267.96 31.56,268.06 31.66,268.06 32.16,268.56 34.58,268.56 IC5.7
FGATE2  (1 unrouted)
  Top 0.61: R32.1 116.89,24.19 119.59,26.89 126.81,26.89 126.81,236.41 arc45 126.72,236.63 124.71,238.65 48.46,238.65 45.55,241.56 45.55,247.74 SL5.4 | SL3.4 45.55,259.67 43.56,261.66 33.76,261.66 29.96,265.46 29.96,268.46 31.36,269.86 31.66,269.86 32.66,270.86 34.4,270.86 IC5.5
GND  (via drill 1)  (3 unrouted)
  Top 0.406: IC1.9 120.06,279.32 118.54,280.85 118.58,282.67 | 118.58,282.67 118.58,282.87 C2.2 | C3.2 118.96,282.29 118.58,282.67 | 93.89,277.06 IC2.3 97.76,277.07 98.58,276.25 102.48,276.25 IC2.21 | U1.2 115.43,264.28 C1.2 112.69,264.24 C8.2 106.26,264.56 100.9,259.2 100.9,257.59 SL2.2 100.89,257.54 100.89,256.07 101.75,255.21 106.69,255.21 107.28,255.8 117.79,255.8 120.65,258.66 124.77,258.66 127.63,261.51 127.63,267.13 127.02,267.75 R4.1 | SL4.3 85.81,275.59 85.7,275.48 | IC2.5 89.78,275.47 arc-45 89.55,275.57 88.76,276.36 86.63,276.36 arc45 86.55,276.33 | R44.1 90.49,268.76 arc45 90.27,268.67 89.36,267.76 86.79,267.76 arc-45 86.57,267.85 85.36,269.06 85.36,271.65 arc-45 85.45,271.88 86.16,272.58 | S2.2 47.35,263 arc-45 47.13,263.09 44.76,265.46 37.89,265.46 arc-45 37.67,265.55 36.96,266.26 36.96,268.88 arc-45 37.05,269.11 37.75,269.8 | 90.66,278.26 89.66,278.26 89.66,278.06 89.66,277.86 90.66,277.86 90.66,278.06 90.66,278.26
  Top 0.6: X2.5 102.85,291.55 103.86,292.56 113.96,292.56 116.16,290.36 116.16,288.16 | 116.16,288.16 116.16,287.96 117.66,286.46 121.46,286.46 123.86,284.06 123.86,280.16 123.02,279.32 IC1.9 | IC2.21 104.47,276.27 105.36,277.16 105.36,278.06 106.76,279.46 106.76,280.06 107.46,280.76 108.46,280.76 109.26,281.56 110.66,281.56 113.16,284.06 113.16,285.16 116.16,288.16 | 68.87,284.93 68.87,286.17 72.01,289.31 72.16,289.46 72.16,293.76 71.76,294.16 71.76,293.74 SL1.4
  Top 0.61: 86.55,276.33 85.7,275.48 85.52,275.3 | 85.52,275.3 85.52,273.22 86.16,272.58 C5.1 88.39,272.57 C6.1 | 66.64,279.09 68.34,279.09 69.41,278.02 69.41,272.74 70.18,271.97 IC6.1 74.93,271.97 C13.1 77.03,271.26 C14.1 81.48,271.26 85.52,275.3 | 66.64,279.09 65.66,279.09 64.74,280 64.71,280 64.62,280.1 64.62,284.21 65.34,284.93 68.87,284.93 | C4.2 55.81,278.41 56.63,277.6 65.14,277.6 66.64,279.09 | 53.84,275.13 55.19,276.48 | IC4.3 39.24,279.82 37.97,279.82 37.66,279.51 37.66,269.89 37.75,269.8 IC5.3 | R6.1 25.5,269.36 arc-45 R16.1 | S3.1 S3.2 73.52,287.8 72.01,289.31 | 93.89,277.06 92.56,277.06 91.56,278.06 90.66,278.06 | 86.63,276.36 86.66,276.36 88.36,278.06 89.66,278.06 | SL2.2 100.87,256.07 100.16,255.36 91.66,255.36 90.46,256.56 90.46,257.78 S1.1 | S2.1 56.12,259.12 57.66,260.66 61.46,260.66 62.46,261.66 62.86,261.66 64.06,262.86 90.38,262.86 S1.2
  Top 0.813: IC3.4 52.79,277.56 arc-45 52.57,277.65 46.66,283.56 36.96,283.56 | 36.96,283.56 34.19,283.56 arc45 33.97,283.47 29.26,278.76 29.26,273.49 arc-45 29.17,273.27 27.46,271.56 25.75,271.56 arc45 25.52,271.47 R6.1 | 37.97,279.82 37.15,280.63 arc-45 37.06,280.86 37.06,283.33 arc45 36.97,283.55 36.96,283.56 | R16.1 25.46,271.13 arc-45 25.55,271.35 25.66,271.46 25.66,263.49 arc45 25.75,263.27 28.16,260.86 | 28.16,260.86 28.16,257.98 | Q16.3 16.96,259.66 17.06,259.56 18.16,259.56 18.16,260.86 18.96,260.86 v19.46,260.36 | v29.06,260.36 29.16,260.76 28.76,260.76 28.36,260.86 28.16,260.86
  Top 1.016: C7.2 55.85,275.82 55.41,276.26 | 55.41,276.26 55.19,276.48 IC3.4 | C4.2 55.81,276.66 55.41,276.26
  Bottom 0.6: S1.2 S1.1
  Bottom 0.813: v19.46,260.36 v29.06,260.36
INT-CAN  (via drill 0.6)
  Top 0.406: 94.36,281.06 v94.46,281.06 94.66,281.06 95.36,280.36 95.36,280.26 IC2.32 | 109.67,280.59 arc45 109.66,279.72 v109.66,280.16 109.76,280.06 R3.2 109.83,276.78 IC1.12
  Bottom 0.6: v94.46,281.06 94.46,280.16 | 100.86,280.86 101.86,280.86 105.86,284.86 111.76,284.86 112.16,284.46 112.16,281.06 111.56,280.46 109.96,280.46 v109.66,280.16
  Bottom 0.61: 94.46,280.16 100.16,280.16 100.86,280.86
LM35
  Top 0.6: IC2.24 102.77,278.67 102.77,279.67 103.86,280.76 103.86,281.96 107.86,285.96 109.16,285.96 110.56,287.36 110.56,289.37 X2.2
MOTOR-
  Bottom 1.016: 125.82,55.66 125.82,56.03 126.77,56.98
  Bottom 1.27: R41.2 33.6,60.54 33.59,60.53
  Bottom 2.54: R18.2 27.15,239.56
  Bottom 3.81: Q4.D 121.08,55.66 125.82,55.66 | Q13.D 121.08,74.48 126.23,74.48 126.77,73.94 | 125.77,93.48 121.08,93.48 Q12.D 126.62,93.56 126.77,93.72 | Q7.D 121.08,112.63 126.69,112.63 126.77,112.71 | Q8.D 126.75,131.66 126.77,131.64 | 125.83,150.7 Q9.D 126.31,150.71 126.77,150.24 | Q11.D 121.08,169.79 126.28,169.79 126.77,169.3 | Q10.D 121.08,188.88 126.64,188.88 126.77,188.75 | Q5.D 121.08,207.92 126.68,207.92 126.77,208.01 | Q6.D 121.08,226.96 125.83,226.96 125.83,226.93 126.77,225.99 126.77,208.01 | 126.77,208.01 126.77,188.75 | 126.77,188.75 126.77,169.3 | 126.77,169.3 126.77,150.24 | 126.77,150.24 126.77,131.64 | 126.77,131.64 126.77,112.71 | 126.77,112.71 126.77,93.72 | 126.77,93.72 126.77,73.94 | 126.77,73.94 126.77,56.98 | R33.2 18.61,212.94 17.89,212.22 18.74,212.22 19.05,211.91 | R34.2 19.59,193.89 19.05,193.35 | R35.2 18.58,174.84 18.21,174.47 18.82,174.47 19.05,174.23 | R36.2 18.56,155.79 18.44,155.67 19.05,155.67 | R37.2 19.78,136.74 19.05,136.01 | R38.2 18.84,117.69 18.36,117.21 18.66,117.21 19.05,117.6 | R39.2 18.53,98.64 18.52,98.64 19.05,98.64 | R40.2 19.74,79.59 19.05,78.9
  Bottom 6.452: 126.77,56.98 127.3,56.98 128.11,57.8 128.33,57.8 130.07,59.54 130.07,59.93 131.82,61.68 131.82,224.68 130.08,226.41 | 130.08,226.41 127.15,226.41 | 130.08,226.41 131.39,226.41 131.64,226.67 131.64,226.2 131.87,225.98 131.87,231.54 126.43,236.98 126.43,237.03 123.08,240.38 27.97,240.38 27.15,239.56 19.05,231.46 19.05,211.91 19.05,193.35 19.05,174.23 19.05,155.67 19.05,136.01 19.05,117.6 19.05,98.64 19.05,78.9 19.05,66 24.52,60.53 33.59,60.53 33.78,60.53
N$1
  Top 0.406: U1.8 125.84,265.55 R4.2
N$2
  Top 0.406: R11.2 115.98,265.55 U1.1 118.12,268.07 119.18,269.12 121.34,269.12 IC1.1
N$3
  Top 0.406: R12.1 116.82,261.74 U1.4 119.73,261.74 120.47,262.48 120.47,266.78 121.45,267.76 122.92,267.76 123.49,268.33 123.49,269.92 123.11,270.29 122.9,270.51 121.45,270.51 IC1.2
N$4
  Top 0.406: IC1.8 119.7,278.05 116.62,281.13 116.66,281.9 Q1.2 116.11,282.72 C2.1
N$5
  Top 0.406: IC1.7 119.3,276.78 114.57,281.51 114.61,284.24 115.4,285.03 119.71,285.03 120.84,283.9 120.84,282.8 Q1.1 120.85,282.65 arc45 120.76,282.42 C3.1
N$6
  Top 0.406: IC2.7 92.3,273.87 91.72,274.46 88.42,274.46 Q2.1
  Top 0.61: C5.2 arc45 87.43,274.44 Q2.1
N$7
  Top 1.27: R19.2 Q4.G
N$8
  Top 0.406: IC1.17 111.56,270.46 110.26,270.46 109.86,270.86 108.56,270.86 106.96,269.26 106.96,268.36 106.86,268.26 106.86,266.96 R1.1
N$9
  Top 0.406: IC2.8 92.47,273.07 90.1,270.7 88.9,270.7 C6.2 88.54,270.48 Q2.2
N$10
  Top 0.813: 22.46,3.53 arc45 23.26,3.56
  Top 1.27: 22.56,246.46 22.46,3.53
N$11  (via drill 0.6)
  Top 0.406: R48.1 14.86,273.06 16.06,271.86 v16.86,271.86 | 101.26,267.16 v101.26,266.76 101.26,267.26 100.86,267.66 99.86,267.66 99.26,268.26 99.26,268.96 97.76,270.46 97.76,271.58 IC2.12
  Bottom 0.406: 17.16,271.06 17.16,271.45 arc45 17.09,271.63 v16.86,271.86
  Bottom 0.6: 17.16,271.06 17.16,270.56 20.96,266.76 v101.26,266.76
N$13
  Top 0.813: D1.A 49.96,282.89 arc-45 49.74,282.98 47.76,284.96 22.69,284.96 arc45 22.47,284.87 18.76,281.16 18.76,278.27 arc-45 18.67,277.24 L1.2
N$14  (via drill 1.2)
  other vias: 83.56,222.06
N$15
  Top 0.406: R12.2 115.02,259.23 R13.1
N$16
  Top 1.27: R22.2 120.92,213.29 Q5.G
N$17
  Top 0.406: R11.1 113.64,267.48 113.32,267.16 112.38,267.16 R14.1
N$18
  Top 1.27: R23.2 121.05,232.53 Q6.G
N$19
  Top 1.27: R24.2 121.02,118.14 Q7.G
N$20
  Top 1.27: R25.2 121.07,137.25 Q8.G
N$21
  Top 1.27: R26.2 121.03,156.34 Q9.G
N$22
  Top 1.27: R27.2 120.96,194.28 Q10.G
N$23
  Top 1.27: R28.2 120.97,175.24 Q11.G
N$24
  Top 1.27: R29.2 121.05,99.12 Q12.G
N$25
  Top 1.27: R30.2 121.04,80.13 Q13.G
N$26
  Top 1.27: R31.2 120.99,41.91 Q14.G
N$27
  Top 1.27: R32.2 Q15.G
N$29
  Bottom 6.452: 44.53,36.73 44.53,33.54 67.1,33.54
N$30
  Bottom 6.452: 67,33.25 67,200.77 88.61,200.77 88.61,53.2 79.06,53.2 79.06,33.81 76.25,33.81 76.25,33.53 62.46,33.53 62.46,41.99 47,41.99 47,38.95 75.43,38.95 75.43,41.09 72.28,41.09 72.28,45.49 73.74,45.49 73.74,48.99 72.84,48.99 72.84,197.22 72.77,197.22 72.77,196.41 83.02,196.41 83.02,57.47 84.16,57.47 84.16,57.14 78.3,57.14 78.3,191.7 76.84,191.7
N$31
  Bottom 6.452: 53.59,164.69 53.59,53.55 53.91,53.55 53.91,216.04 62.21,216.04 62.21,216.2 102.21,216.2 102.21,12.47 104.02,12.47 104.02,12.74 111.06,12.74 111.06,16.66 108.49,16.66 108.49,220.13 113.17,220.13 113.17,220.37 53.66,220.37 53.66,200.94 54.36,200.94 54.36,206.62 62.55,214.81 93.87,214.81 103.33,205.36 103.33,206.13 97.28,212.18 56.9,212.18 56.12,211.4
N$32
  Bottom 6.452: 98.97,47.24 98.97,42.9 98.87,42.8 93.72,42.8 92.51,41.58 92.51,26.68 89.8,23.98 89.8,23.71 89.86,11.67 89.86,22.31 90.12,22.33 90.32,11.33 112.28,11.31 112.32,11.35 103.94,11.35 98.91,16.38 91.57,16.98 90.13,16.72 91.57,16.72 97.21,22.36 97.21,46.05 100.03,48.87 99.69,48.87 92.25,41.43
N$33
  Bottom 6.452: 58.17,40.07 58.17,11.76 58.06,11.65 44.52,11.65 44.29,11.87 44.29,24.05 53.21,32.97 49.37,32.97 47,30.6 50.84,30.6 54.45,26.99 54.45,16.5 53.32,15.37 49.93,15.37 48.92,16.38 48.92,21.57 50.16,22.81
N$34
  Bottom 6.452: 57.48,11.68 64.7,11.68 64.7,32.55 65.09,32.94
N$35
  Bottom 6.452: 41.18,219.54 41.18,11.25 64.47,11.25 64.74,11.52 64.74,13.01 62.71,15.04 62.71,28.17 61.76,29.12
N$36
  Bottom 6.452: 25.25,64.59 25.25,229.43 31.7,235.88 112.97,235.88 116.48,239.39
N$37
  Bottom 6.452: 114.66,237.4 | 114.66,237.4 110.66,233.4 110.66,233.38 109.06,231.78 28.9,231.78 27.33,230.21
N$39  (1 unrouted)
N$40  (via drill 0.6)
  Bottom 0.406: v109.46,265.56 109.46,263.56
N$41  (via drill 0.6)
  other vias: 109.36,263.46
N$42  (via drill 0.6)
  other vias: 82.96,283.16
N$43
  Top 1.27: 18.66,3.66 18.66,245.85 arc-45 18.73,246.03 20.56,247.86
N$44  (via drill 1.2)
  other vias: 83.66,219.96
N$45  (via drill 1.2)
  other vias: 43.66,223.36
N$46
  Bottom 0.813: 44.06,221.56 44.06,221.39 arc45 44.15,221.17 44.56,220.76 44.56,223.63 arc45 44.47,223.85 44.16,224.16 42.69,224.16 arc45 42.47,224.07 41.36,222.96 41.93,222.96 arc45 42.15,223.05 42.66,223.56 42.66,222.99 arc45 42.75,222.77 43.46,222.06 43.93,222.06 arc45 44.15,222.15 44.36,222.36
N$47
  Top 6.452: 73.36,20.76 73.36,11.26 80.36,11.26 80.36,21.93 arc45 80.27,22.15 80.26,22.16 80.26,20.09 arc-45 80.17,19.87 77.16,16.86
N$48
  Top 6.452: 40.96,11.26 41.06,11.26 | 41.06,11.26 64.33,11.26 arc45 64.55,11.35 64.66,11.46 64.66,14.13 arc45 64.57,14.35 64.56,14.36 41.06,14.36 41.06,11.26
N$49
  Top 6.452: 90.36,11.36 103.63,11.36 arc-45 103.85,11.27 103.96,11.16 103.96,12.03 arc45 103.87,12.25 101.26,14.86 89.76,14.86 89.76,11.26
N$50  (via drill 8)
  other vias: 44.86,8.56
N$51  (via drill 8)
  other vias: 60.96,8.56
N$52  (via drill 8)
  other vias: 76.86,8.46
N$53  (via drill 8)
  Bottom 0.406: v94.86,8.66 v108.26,8.66
N$54  (via drill 8)
  Top 0.406: v135.06,8.46 v146.96,8.46
N$55
  Top 0.406: 23.7,272.76 arc45 R10.1
  Top 0.61: R15.1 R10.1 | 23.7,272.76 R6.2
N$56
  Top 0.813: 42.66,224.06 42.76,224.16 44.23,224.16 arc-45 44.45,224.07 44.56,223.96 44.56,222.79 arc-45 44.47,222.57 44.36,222.46 42.99,222.46 arc-45 42.77,222.55 42.76,222.56 arc45 42.69,222.73 42.56,222.86 42.56,223.56
N$57
  Top 0.406: IC2.10 96.2,268.86 arc-45 R21.2
N$58
  Top 0.406: R21.1 R44.2
N$59
  Top 0.61: R16.2 R20.1 R17.1
N$60
  Top 0.406: 0.86,297.66 153.96,297.66 153.86,254.36 0.46,254.36 0.46,297.46
N$61
  Bottom 0.406: 0.86,297.46 153.86,297.66 153.76,254.36 0.46,254.36 0.46,297.56
N$62
  Bottom 0.406: 0.66,250.86 154.06,250.86 154.06,0.06 0.66,0.06 0.66,2.86 0.56,2.86 0.56,73.76 0.66,73.76 0.66,162.66 0.36,162.66 0.36,250.66
N$63
  Top 0.406: 0.86,250.86 154.06,250.86 154.06,0.06 0.66,0.06 0.66,2.86 0.56,2.86 0.56,5.96 0.46,5.96 0.46,250.76 1.06,250.76
N$64
  Bottom 0.6: 55.96,263.06 56.16,263.06 56.16,257.76
PG
  Top 0.406: R8.2 R9.2 | R9.2 | R9.2 44.13,273.92 arc45 44.23,273.69 51.76,266.16 93.33,266.16 arc45 93.55,266.25 94.76,267.46 94.76,270.81 arc-45 94.85,271.03 IC2.9
PG1
  Top 0.406: 42.2,278.63 R9.1
  Top 0.61: 42.2,278.63 IC4.2
PG2
  Top 0.61: IC4.4 42.29,281.17 R8.1
PGATE1  (1 unrouted)
  Top 0.61: R25.1 116.73,152.52 114.9,154.34 114.9,232.09 113.88,233.11 113.88,233.14 113.25,233.77 46.69,233.77 39.6,240.86 39.6,244.05 38.01,245.65 38.01,247.73 SL5.1 | SL3.1 35.87,257.85 28.76,264.96 28.76,269.06 32.46,272.76 32.46,278.06 33.06,278.66 34.59,278.66 IC4.7
  Top 1.016: R19.1 116.8,79.99 R30.1 116.95,99 R29.1 116.82,118.06 R24.1 R25.1
PGATE2  (1 unrouted)
  Top 0.61: 116.85,232.4 116.85,234.02 115.44,235.43 47.06,235.43 41.31,241.17 41.31,244.78 40.39,245.7 40.39,247.66 SL5.2 | SL3.2 40.47,256.67 39.36,255.56 36.36,255.56 27.26,264.66 27.26,269.36 30.76,272.86 30.76,278.46 32.36,280.06 32.36,280.26 33.16,281.06 34.51,281.06 IC4.5
  Top 1.016: R26.1 116.63,175.14 R28.1 116.73,193.9 R27.1 117.11,213.03 R22.1 116.85,232.4 R23.1
PGND  (via drill 1.2)  (1 unrouted)
  Top 0.813: SL8.4 28.43,247.86 arc-45 28.65,247.77 | 83.56,222.46 v83.56,222.06 84.17,221.45 arc45 84.39,221.36 107.26,221.36 v112.86,215.76
  Top 1.27: 28.65,247.77 29.75,247.77 arc-45 29.93,247.69 48.76,228.86 arc45 48.83,228.69 55.16,222.36 83.16,222.36 arc-45 83.33,222.29 v83.56,222.06
  Bottom 0.813: v83.66,217.86 83.16,217.36 83.66,217.46 v83.56,222.06 | v112.86,215.76 112.72,215.76
  Bottom 1.016: C22.- 53.77,206.05 62.98,215.27 111.56,215.27 112.72,216.43
  Bottom 3.81: Q6.S 117.06,221.32 116.93,221.19 116.93,221.26 114.61,221.26 112.72,219.37 112.72,216.43 112.72,215.76 112.72,201.97 | Q5.S 117.09,202.27 | 117.09,202.27 117.02,202.2 | Q10.S 117.01,183.22 116.93,183.3 112.78,183.3 112.72,183.24 | Q11.S 116.98,164.17 116.84,164.03 112.97,164.03 112.72,164.28 | Q9.S 116.94,145.12 | 116.94,145.12 116.93,145.13 | Q8.S 121.08,126.14 112.86,126.14 112.72,126.29 | Q7.S 121.08,106.96 112.92,106.96 112.72,107.16 | Q12.S | Q13.S 121.08,68.89 112.74,68.89 112.72,68.91 | Q4.S 121.08,49.99 113.17,49.99 112.72,50.44 | 117.21,30.9 121.08,30.9 Q14.S 113.02,30.82 112.72,31.12 | Q15.S 121.08,11.91 117.12,11.91 117.1,11.93 112.65,11.93 112.72,11.99 112.72,31.12 | 112.72,201.97 112.72,183.24 | 112.72,183.24 112.72,164.28 | 112.72,164.28 112.72,145.56 | 112.72,145.56 112.72,126.69 | 112.72,126.69 112.72,126.29 | 112.72,126.29 112.72,107.16 | 112.72,107.16 112.72,88.17 | 112.72,88.17 112.72,68.91 | 112.72,68.91 112.72,50.44 | 112.72,50.44 112.72,31.12 | Q12.S 112.91,87.97 112.72,88.17 | 116.94,145.12 113.16,145.12 112.72,145.56 | 117.09,202.27 113.02,202.27 112.72,201.97 | C9.- 100.76,163.39 100.38,163.01 100.38,126.96 C11.- | C11.- C12.- | C12.- 100.76,89.5 100.38,89.12 | 100.38,89.12 100.38,89.37 C12.- | 100.38,89.12 100.38,53.72 100.66,53.44 100.66,53.02 C18.- | C23.- C22.- C21.- C20.- C19.- | C11.- 111.96,126.86 112.72,126.69
PVCC  (3 unrouted)
  Top 0.813: R17.2 21.86,264.49 arc45 21.95,264.27 24.16,262.06 24.63,262.06 arc-45 24.85,261.97 25.66,261.16 25.66,258.03 arc-45 SL7.3 | 34.56,222.12 arc45 34.65,221.89 R18.1
  Top 1.27: 25.73,246.42 25.73,244.99 arc45 25.8,244.82 32.76,237.86 34.86,237.86 arc-45 35.03,237.79 44.26,228.56 44.26,221.96 arc-45 44.19,221.79 43.06,220.66 35.99,220.66 arc-45 35.81,220.73 R18.1
  Bottom 3.81: C9.+ C10.+ 90.6,126.83 89.97,126.21 89.97,90.37 | 89.97,90.37 C12.+ | 89.97,90.37 89.97,52.6 90.25,52.32 64.95,52.32 | C21.+ C22.+ C23.+ | C21.+ C20.+ C19.+ 64.53,52.32 64.95,52.32 | C21.+ 89.93,126.61 C11.+ | R43.1 40.77,12.25 43.66,14.91 43.63,30.91 | 43.63,30.91 43.62,50.09 | 43.62,50.09 43.61,69.33 | 43.61,69.33 43.55,88.8 | 43.55,88.8 43.59,107.35 | 43.59,107.35 43.53,126.04 | 43.53,126.04 43.52,145.11 | 43.52,145.11 43.51,164.48 | 43.51,164.48 43.5,183.84 | 43.5,183.84 43.49,203.07 | 43.49,203.07 43.48,215.86 43.47,218.99 43.28,219.43 40.91,221.82 R18.1 | R33.1 34.72,203.07 43.49,203.07 | R34.1 34.72,183.84 43.5,183.84 | R35.1 34.72,164.48 43.51,164.48 | R36.1 34.72,145.11 43.52,145.11 | R37.1 34.72,126.04 43.53,126.04 | R38.1 34.72,107.35 43.59,107.35 | R39.1 34.72,88.34 42.86,88.34 42.86,88.67 43.55,88.8 | R41.1 34.72,50.32 43.62,50.09 | R40.1 34.72,69.33 43.61,69.33 | R42.1 34.72,31.14 43.02,31.14 | 43.02,31.14 | 43.02,31.14 43.63,30.91 | 43.53,126.04 43.53,38.52 64.95,38.52 64.95,52.32
REL
  Top 0.61: Q16.1 10.96,259.66 9.16,261.46 9.16,270.76 11.56,273.16 12.96,273.16 R48.2
REL.PRE  (1 unrouted)
  Top 0.813: Q16.4 14.76,258.66 arc45 14.83,258.49 15.66,257.66 20.15,257.66 arc45 20.32,257.73 SL7.1
RESET
  Top 0.6: IC2.29 97.8,283.22 95.16,285.86 84.66,285.86 82.16,283.36 82.16,277.88 R2.1
  Top 0.61: S3.3 S3.4 81.52,282.72 82.16,283.36
RX
  Top 0.6: IC2.30 97,282.02 95.16,283.86 89.06,283.86 88.46,283.26 88.46,280.94 SL4.2
SCK-CAN
  Top 0.406: IC2.17 104.9,273.07 107.3,275.47 111.54,275.47 IC1.13
SCL
  Top 0.6: IC2.28 98.6,284.32 96.66,286.26 96.66,287.16 95.56,288.26 84.36,288.26 81.36,291.26 77.36,291.26 76.96,291.66 76.96,293.59 SL1.2
SDA
  Top 0.6: IC2.27 99.4,285.02 97.86,286.56 97.86,287.36 95.86,289.36 84.76,289.36 80.56,293.56 79.56,293.56 SL1.1
SI-CAN
  Top 0.406: IC1.14 107.63,274.24 105.61,272.23 105.61,272.22 105.53,272.13 101.92,272.13 100.77,273.28 100.38,273.28 100.18,273.08 100.18,271.6 IC2.15
SO-CAN
  Top 0.406: IC1.15 107.66,272.97 106.22,271.53 106.22,271.52 105.72,271.02 100.99,271.02 IC2.16
TX
  Top 0.6: IC2.31 96.2,281.52 94.86,282.86 91.66,282.86 90.86,282.06 90.86,280.87 SL4.1
V.14V  (via drill 0.6)
  Top 0.406: R10.2 21.86,272.46 21.76,272.36 21.16,272.36 21.06,272.26 21.06,271.96 21.16,271.86 v21.16,271.76 | 102.46,277.06 IC2.22 102.52,277.1 104.1,277.1 104.66,277.66 104.66,278.63 105.93,279.89 | 105.93,279.9 105.93,280.83 106.86,281.76 107.86,281.76 v108.86,282.76
  Top 0.61: 105.93,279.9 105.93,279.89 | 105.93,279.89
  Bottom 0.406: v108.86,282.76 105.13,279.26
  Bottom 0.6: v108.86,282.76 104.56,278.56 99.46,278.56 97.16,276.26 94.26,276.26 93.26,277.26 57.96,277.26 52.86,282.36 31.76,282.36 v21.16,271.76
V.HV  (via drill 0.6)
  Top 0.406: R20.2 v21.86,269.06 | IC2.19 104.17,274.67 106.06,276.56 106.06,277.5 106.8,278.24 arc-45 106.79,278.24 107.34,278.24 107.66,278.56 107.66,279.06 v107.96,279.36
  Bottom 0.6: v21.86,269.06 22.06,269.06 22.76,268.36 92.46,268.36 98.66,274.56 98.66,276.16 99.86,277.36 106.06,277.36 107.66,278.96 107.66,279.06 v107.96,279.36

### Text on the board
Top: MOTOT-GND
Pads: RaceAutoElectro.com/ | /100kw.Logic.Board/ | F-GND | RaceAutoElectro.com/100kw.Power.Board/ | HV+ | HV-GND | REL.PRE | 14v